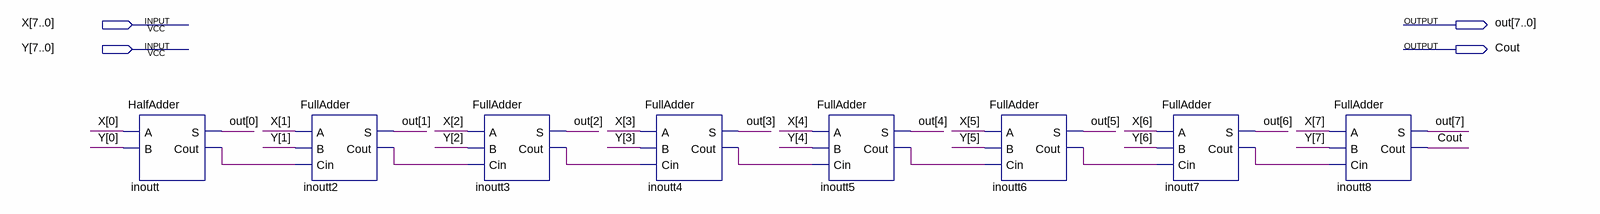
[diagram p0: schematic sheet]
// Quartus schematic RCA.bdf as structural Verilog: 8 symbols, 4 pins
module RCA (
  input  [7:0] X,
  input  [7:0] Y,
  output [7:0] out,
  output Cout
);

  wire inoutt2_cout, inoutt3_cout, inoutt4_cout, inoutt5_cout, inoutt6_cout, inoutt7_cout, inoutt_cout;

  HalfAdder inoutt (.A(X[0]), .B(Y[0]), .S(out[0]), .Cout(inoutt_cout));
  FullAdder inoutt2 (.A(X[1]), .B(Y[1]), .Cin(inoutt_cout), .S(out[1]), .Cout(inoutt2_cout));
  FullAdder inoutt3 (.A(X[2]), .B(Y[2]), .Cin(inoutt2_cout), .S(out[2]), .Cout(inoutt3_cout));
  FullAdder inoutt4 (.A(X[3]), .B(Y[3]), .Cin(inoutt3_cout), .S(out[3]), .Cout(inoutt4_cout));
  FullAdder inoutt5 (.A(X[4]), .B(Y[4]), .Cin(inoutt4_cout), .S(out[4]), .Cout(inoutt5_cout));
  FullAdder inoutt6 (.A(X[5]), .B(Y[5]), .Cin(inoutt5_cout), .S(out[5]), .Cout(inoutt6_cout));
  FullAdder inoutt7 (.A(X[6]), .B(Y[6]), .Cin(inoutt6_cout), .S(out[6]), .Cout(inoutt7_cout));
  FullAdder inoutt8 (.A(X[7]), .B(Y[7]), .Cin(inoutt7_cout), .S(out[7]), .Cout(Cout));
endmodule
